# EAGLE design motorController (EAGLE 7.5.0)

## Sheet 1 of 6: MAIN
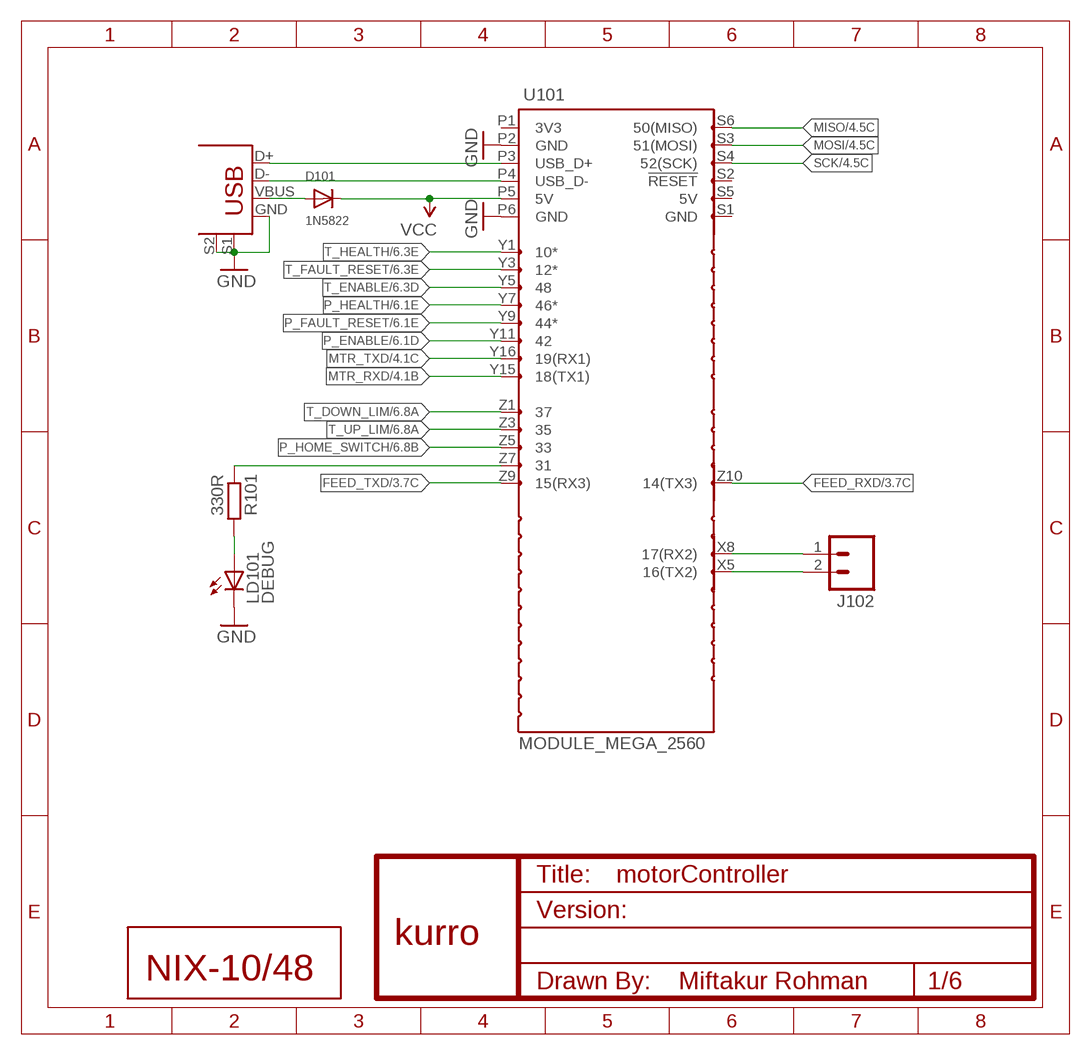
[diagram p0: schematic, sheet 1]

### Parts
D101  1N5822  DIODESMA  [SMADIODE]
J101  USB+SHIELD  [USB-B-PTH]
J102  M02POLAR  [MOLEX-1X2]
LD101  DEBUG  LED5MM  [LED5MM]
R101  330R  R-EU_R0603  [R0603]
U101  MODULE_MEGA_2560  MOD_MEGA_LAYOUT  [MOD_MEGA_LAYOUT]
U$1  KURRO_FOOTPRINT  [KURRO-LOGO]
U$2  NIX  [NIX-XX/XXX]
U$3  MOD_MEGA_LAYOUT_ICSP  [MOD_MEGA_LAYOUT_ICSP]
U$4  MOD_MEGA_LAYOUT_SERIAL1  [MOD_MEGA_LAYOUT_SERIAL1]
U$5  MOD_MEGA_LAYOUT_SERIAL2  [MOD_MEGA_LAYOUT_SERIAL2]
U$6  MOD_MEGA_LAYOUT_SERIAL3  [MOD_MEGA_LAYOUT_SERIAL3]
U$7  MOD_MEGA_LAYOUT_Z_ODD  [MOD_MEGA_LAYOUT_Z_ODD]
U$9  MOD_MEGA_LAYOUT_Y_ODD  [MOD_MEGA_LAYOUT_Y_ODD]

### Nets
FEED_RXD: U$6.Z10(14(TX3)) ; also sheet 3
FEED_TXD: U$6.Z9(15(RX3)) ; also sheet 3
GND: J101.GND J101.S1 J101.S2 LD101.K(C) U101.P2(GND) U101.P6(GND) ; also sheet 2,3,4,5,6
MISO: U$3.S6(50(MISO)) ; also sheet 4
MOSI: U$3.S3(51(MOSI)) ; also sheet 4
MTR_RXD: U$4.Y15(18(TX1)) ; also sheet 4
MTR_TXD: U$4.Y16(19(RX1)) ; also sheet 4
N$3: LD101.A R101.2
N$4: J101.D+ U101.P3(USB_D+)
N$7: J101.D- U101.P4(USB_D-)
N$8: D101.A J101.VBUS
N$9: R101.1 U$7.Z7
N$10: J102.1 U$5.X8(17(RX2))
N$11: J102.2 U$5.X5(16(TX2))
P_ENABLE: U$9.Y11 ; also sheet 6
P_FAULT_RESET: U$9.Y9(44*) ; also sheet 6
P_HEALTH: U$9.Y7(46*) ; also sheet 6
P_HOME_SWITCH: U$7.Z5 ; also sheet 6
SCK: U$3.S4(52(SCK)) ; also sheet 4
T_DOWN_LIM: U$7.Z1 ; also sheet 6
T_ENABLE: U$9.Y5 ; also sheet 6
T_FAULT_RESET: U$9.Y3(12*) ; also sheet 6
T_HEALTH: U$9.Y1(10*) ; also sheet 6
T_UP_LIM: U$7.Z3 ; also sheet 6
VCC: D101.C U101.P5(5V) ; also sheet 2,3,4
Unconnected: U101.P1(3V3) U$3.S1(GND) U$3.S2(!RESET) U$3.S5(5V)

## Sheet 2 of 6: PSU
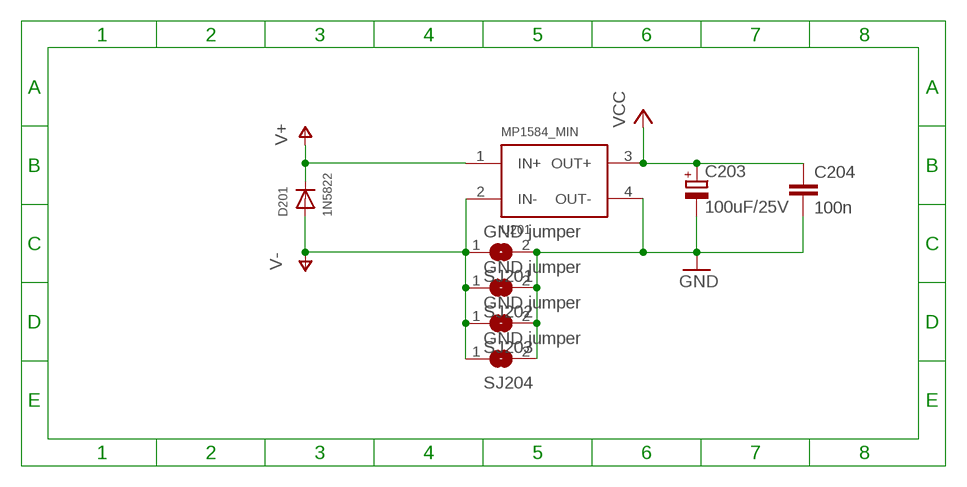
[diagram p1: schematic, sheet 2]

### Parts
C203  100uF/25V  CPOL-EUE5-10.5  [E5-10,5]
C204  100n  C-EUC0603  [C0603]
D201  1N5822  DIODESMA  [SMADIODE]
SJ201  GND jumper  SJS  [SJS]
SJ202  GND jumper  SJS  [SJS]
SJ203  GND jumper  SJS  [SJS]
SJ204  GND jumper  SJS  [SJS]
U201  MP1584_MIN  [MP1584_MIN]

### Nets
GND: C203.- C204.2 SJ201.2 SJ202.2 SJ203.2 SJ204.2 U201.4(OUT-) ; also sheet 1,3,4,5,6
V+ [pwr]: D201.C U201.1(IN+) ; also sheet 5,6
V- [pwr]: D201.A SJ201.1 SJ202.1 SJ203.1 SJ204.1 U201.2(IN-) ; also sheet 5,6
VCC: C203.+ C204.1 U201.3(OUT+) ; also sheet 1,3,4

## Sheet 3 of 6: FEEDBACK
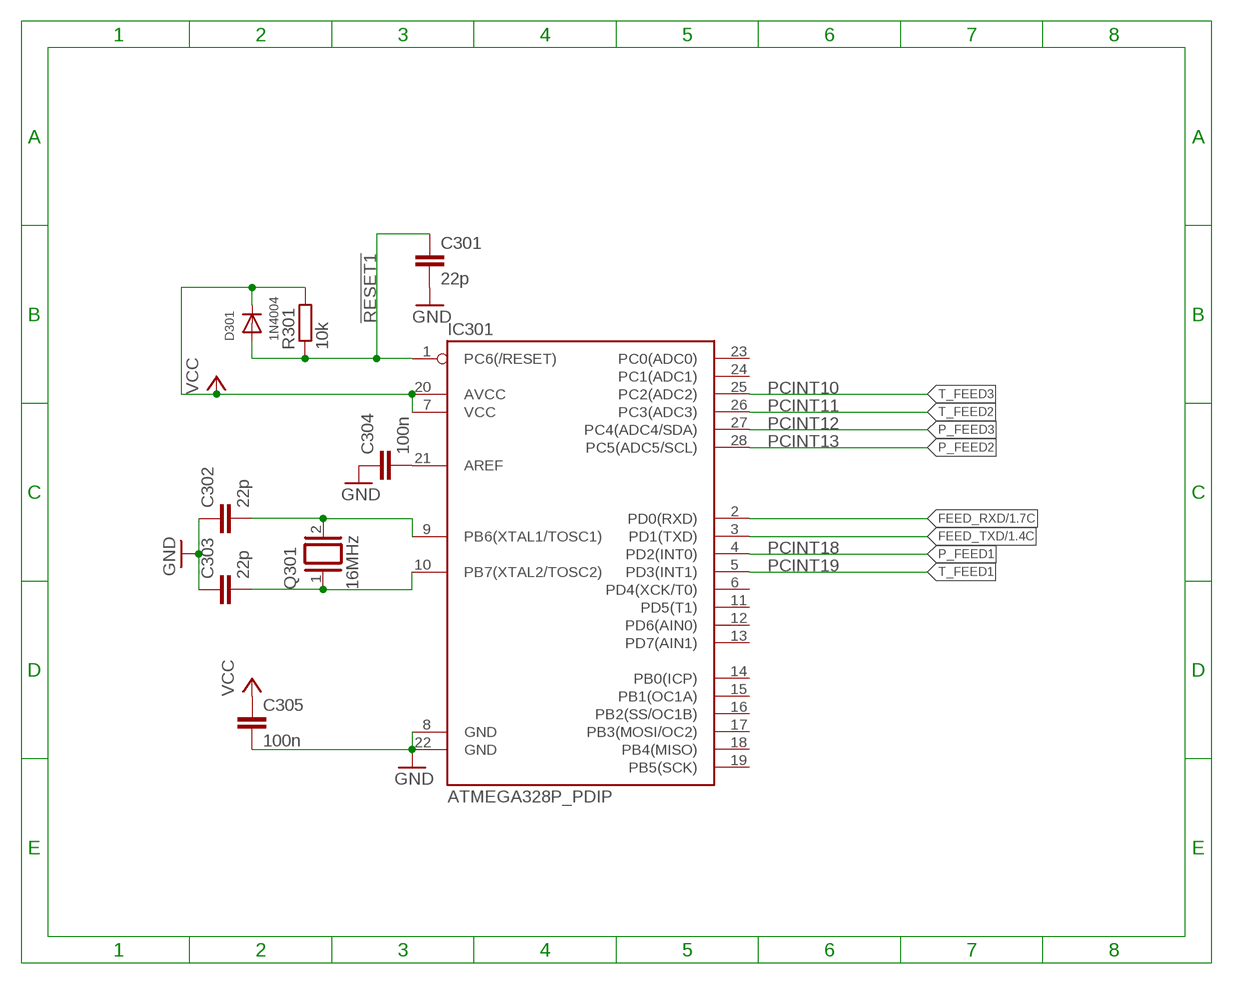
[diagram p2: schematic, sheet 3]

### Parts
C301  22p  C-EUC0603  [C0603]
C302  22p  C-EUC0603  [C0603]
C303  22p  C-EUC0603  [C0603]
C304  100n  C-EUC0603  [C0603]
C305  100n  C-EUC0603  [C0603]
D301  1N4004  DIODESOD-323F  [SOD-323F]
IC301  ATMEGA328P_PDIP  [DIL28-3]
Q301  16MHz  XTAL/S  [QS]
R301  10k  R-EU_R0603  [R0603]

### Nets
!RESET1: C301.1 D301.A IC301.1(PC6(/RESET)) R301.1
FEED_RXD: IC301.2(PD0(RXD)) ; also sheet 1
FEED_TXD: IC301.3(PD1(TXD)) ; also sheet 1
GND: C301.2 C302.1 C303.1 C304.1 C305.2 IC301.8(GND) IC301.22(GND) ; also sheet 1,2,4,5,6
N$5: C303.2 IC301.10(PB7(XTAL2/TOSC2)) Q301.1
N$6: C302.2 IC301.9(PB6(XTAL1/TOSC1)) Q301.2
N$14: C304.2 IC301.21(AREF)
P_FEED1: IC301.4(PD2(INT0)) ; also sheet 6
P_FEED2: IC301.28(PC5(ADC5/SCL)) ; also sheet 6
P_FEED3: IC301.27(PC4(ADC4/SDA)) ; also sheet 6
T_FEED1: IC301.5(PD3(INT1)) ; also sheet 6
T_FEED2: IC301.26(PC3(ADC3)) ; also sheet 6
T_FEED3: IC301.25(PC2(ADC2)) ; also sheet 6
VCC: C305.1 D301.C IC301.7(VCC) IC301.20(AVCC) R301.2 ; also sheet 1,2,4
Unconnected: IC301.6(PD4(XCK/T0)) IC301.11(PD5(T1)) IC301.12(PD6(AIN0)) IC301.13(PD7(AIN1)) IC301.14(PB0(ICP)) IC301.15(PB1(OC1A)) IC301.16(PB2(SS/OC1B)) IC301.17(PB3(MOSI/OC2)) IC301.18(PB4(MISO)) IC301.19(PB5(SCK)) IC301.23(PC0(ADC0)) IC301.24(PC1(ADC1))

### Notes on the sheet
- PCINT10
- PCINT11
- PCINT12
- PCINT13
- PCINT18
- PCINT19

## Sheet 4 of 6: COMM
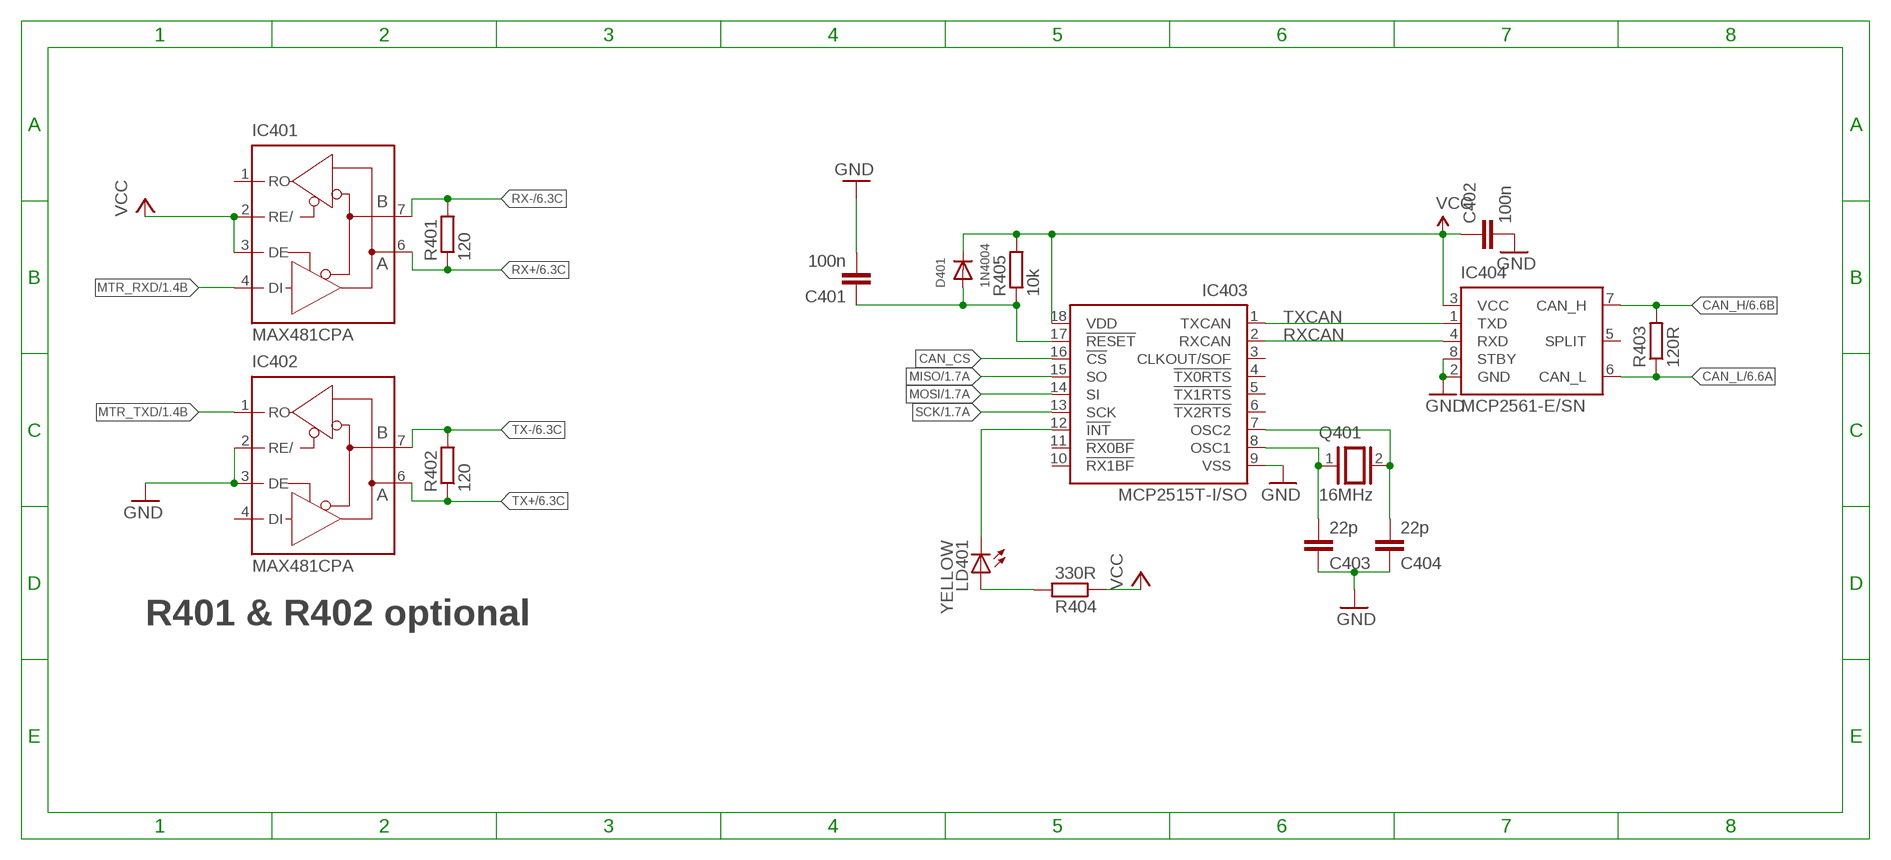
[diagram p3: schematic, sheet 4]

### Parts
C401  100n  C-EUC0603  [C0603]
C402  100n  C-EUC0603  [C0603]
C403  22p  C-EUC0603  [C0603]
C404  22p  C-EUC0603  [C0603]
D401  1N4004  DIODESOD-323F  [SOD-323F]
IC401  MAX481CPA  [DIL08]
IC402  MAX481CPA  [DIL08]
IC403  MCP2515T-I/SO  [SO-18]
IC404  MCP2561-E/SN  [SOIC-8]
LD401  YELLOW  LED5MM  [LED5MM]
Q401  16MHz  XTAL/S  [QS]
R401  120  R-EU_R0603  [R0603]
R402  120  R-EU_R0603  [R0603]
R403  120R  R-EU_R0603  [R0603]
R404  330R  R-EU_R0603  [R0603]
R405  10k  R-EU_R0603  [R0603]

### Nets
CAN_CS: IC403.16(!CS)
CAN_H: IC404.7(CAN_H) R403.2 ; also sheet 6
CAN_INT: IC403.12(!INT) LD401.K(C)
CAN_L: IC404.6(CAN_L) R403.1 ; also sheet 6
GND: C401.2 C402.2 C403.1 C404.1 IC402.2(RE/) IC402.3(DE) IC403.9(VSS) IC404.2(GND) IC404.8(STBY) ; also sheet 1,2,3,5,6
MISO: IC403.15(SO) ; also sheet 1
MOSI: IC403.14(SI) ; also sheet 1
MTR_RXD: IC401.4(DI) ; also sheet 1
MTR_TXD: IC402.1(RO) ; also sheet 1
N$21: C401.1 D401.A IC403.17(!RESET) R405.1
N$22: C403.2 IC403.8(OSC1) Q401.1
N$23: C404.2 IC403.7(OSC2) Q401.2
N$24: LD401.A R404.2
RX+: IC401.6(A) R401.1 ; also sheet 6
RX-: IC401.7(B) R401.2 ; also sheet 6
RXCAN: IC403.2(RXCAN) IC404.4(RXD)
SCK: IC403.13(SCK) ; also sheet 1
TX+: IC402.6(A) R402.1 ; also sheet 6
TX-: IC402.7(B) R402.2 ; also sheet 6
TXCAN: IC403.1(TXCAN) IC404.1(TXD)
VCC: C402.1 D401.C IC401.2(RE/) IC401.3(DE) IC403.18(VDD) IC404.3(VCC) R404.1 R405.2 ; also sheet 1,2,3
Unconnected: IC401.1(RO) IC402.4(DI) IC403.3(CLKOUT/SOF) IC403.4(!TX0RTS) IC403.5(!TX1RTS) IC403.6(!TX2RTS) IC403.10(!RX1BF) IC403.11(!RX0BF) IC404.5(SPLIT)

### Notes on the sheet
- R401 & R402 optional

## Sheet 5 of 6: TRIGGER
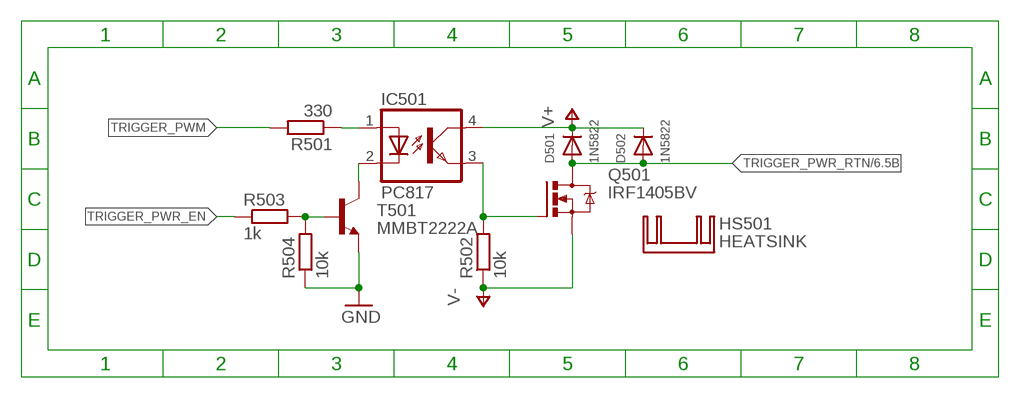
[diagram p4: schematic, sheet 5]

### Parts
D501  1N5822  DIODESMA  [SMADIODE]
D502  1N5822  DIODESMA  [SMADIODE]
HS501  HEATSINK  TO220T30  [BV_150X105]
IC501  PC817  [DIL04]
Q501  IRF1405BV  [TO220BV]
R501  330  R-EU_R0603  [R0603]
R502  10k  R-EU_R0603  [R0603]
R503  1k  R-EU_R0603  [R0603]
R504  10k  R-EU_R0603  [R0603]
T501  MMBT2222A  TRANSISTOR_NPNSOT23  [SOT23]

### Nets
GND: R504.1 T501.2(E) ; also sheet 1,2,3,4,6
N$1: IC501.2(C) T501.3(C)
N$85: R503.2 R504.2 T501.1(B)
N$86: IC501.1(A) R501.1
N$89: IC501.3(EMIT) Q501.G R502.2
TRIGGER_PWM: R501.2
TRIGGER_PWR_EN: R503.1
TRIGGER_PWR_RTN [pwr]: D501.A D502.A Q501.D ; also sheet 6
V+ [pwr]: D501.C D502.C IC501.4(COL) ; also sheet 2,6
V- [pwr]: Q501.S R502.1 ; also sheet 2,6

## Sheet 6 of 6: CONNECTOR
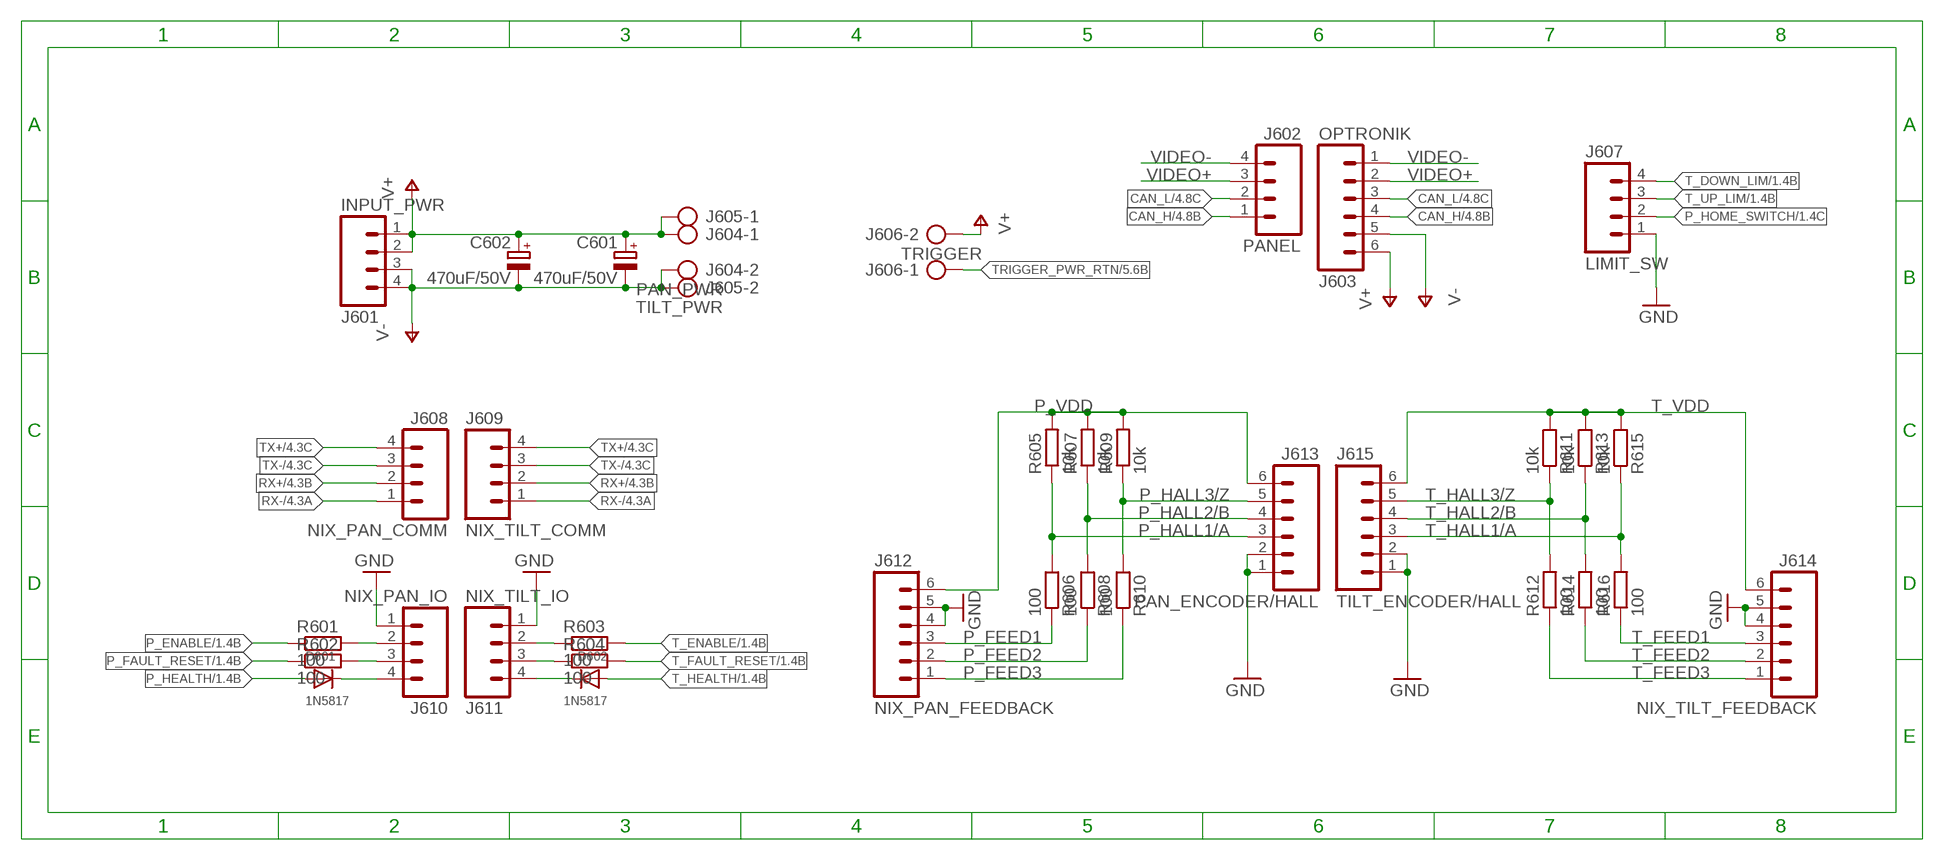
[diagram p5: schematic, sheet 6]

### Parts
C601  470uF/50V  CPOL-EUE5-10.5  [E5-10,5]
C602  470uF/50V  CPOL-EUE5-10.5  [E5-10,5]
D601  1N5817  DIODESOD-323F  [SOD-323F]
D602  1N5817  DIODESOD-323F  [SOD-323F]
J601  INPUT_PWR  M04-XH-RA  [XH-4-RA]
J602  PANEL  M04-XH-RA  [XH-4-RA]
J603  OPTRONIK  M06-XH-RA  [XH-6-RA]
J604  PAN_PWR  AK200/2  [AK200/2]
J605  TILT_PWR  AK200/2  [AK200/2]
J606  TRIGGER  AK200/2  [AK200/2]
J607  LIMIT_SW  M04-XH-RA  [XH-4-RA]
J608  NIX_PAN_COMM  M04-XH-RA  [XH-4-RA]
J609  NIX_TILT_COMM  M04-XH-RA  [XH-4-RA]
J610  NIX_PAN_IO  M04-XH-RA  [XH-4-RA]
J611  NIX_TILT_IO  M04-XH-RA  [XH-4-RA]
J612  NIX_PAN_FEEDBACK  M06-XH-RA  [XH-6-RA]
J613  PAN_ENCODER/HALL  M06POLAR  [MOLEX-1X6]
J614  NIX_TILT_FEEDBACK  M06-XH-RA  [XH-6-RA]
J615  TILT_ENCODER/HALL  M06POLAR  [MOLEX-1X6]
R601  100  R-EU_R0603  [R0603]
R602  100  R-EU_R0603  [R0603]
R603  100  R-EU_R0603  [R0603]
R604  100  R-EU_R0603  [R0603]
R605  10k  R-EU_R0603  [R0603]
R606  100  R-EU_R0603  [R0603]
R607  10k  R-EU_R0603  [R0603]
R608  100  R-EU_R0603  [R0603]
R609  10k  R-EU_R0603  [R0603]
R610  100  R-EU_R0603  [R0603]
R611  10k  R-EU_R0603  [R0603]
R612  100  R-EU_R0603  [R0603]
R613  10k  R-EU_R0603  [R0603]
R614  100  R-EU_R0603  [R0603]
R615  10k  R-EU_R0603  [R0603]
R616  100  R-EU_R0603  [R0603]

### Nets
CAN_H: J602.1 J603.4 ; also sheet 4
CAN_L: J602.2 J603.3 ; also sheet 4
GND: J607.1 J610.1 J611.1 J612.4 J612.5 J613.1 J613.2 J614.4 J614.5 J615.1 J615.2 ; also sheet 1,2,3,4,5
N$19: J611.2 R603.1
N$20: J611.3 R604.1
N$90: D602.C J611.4
N$106: D601.C J610.4
N$107: J610.2 R601.2
N$108: J610.3 R602.2
P_ENABLE: R601.1 ; also sheet 1
P_FAULT_RESET: R602.1 ; also sheet 1
P_FEED1: J612.3 R606.1 ; also sheet 3
P_FEED2: J612.2 R608.1 ; also sheet 3
P_FEED3: J612.1 R610.1 ; also sheet 3
P_HALL1/A: J613.3 R605.1 R606.2
P_HALL2/B: J613.4 R607.1 R608.2
P_HALL3/Z: J613.5 R609.1 R610.2
P_HEALTH: D601.A ; also sheet 1
P_HOME_SWITCH: J607.2 ; also sheet 1
P_VDD: J612.6 J613.6 R605.2 R607.2 R609.2
RX+: J608.2 J609.2 ; also sheet 4
RX-: J608.1 J609.1 ; also sheet 4
T_DOWN_LIM: J607.4 ; also sheet 1
T_ENABLE: R603.2 ; also sheet 1
T_FAULT_RESET: R604.2 ; also sheet 1
T_FEED1: J614.3 R616.1 ; also sheet 3
T_FEED2: J614.2 R614.1 ; also sheet 3
T_FEED3: J614.1 R612.1 ; also sheet 3
T_HALL1/A: J615.3 R615.1 R616.2
T_HALL2/B: J615.4 R613.1 R614.2
T_HALL3/Z: J615.5 R611.1 R612.2
T_HEALTH: D602.A ; also sheet 1
T_UP_LIM: J607.3 ; also sheet 1
T_VDD: J614.6 J615.6 R611.2 R613.2 R615.2
TRIGGER_PWR_RTN [pwr]: J606.1 ; also sheet 5
TX+: J608.4 J609.4 ; also sheet 4
TX-: J608.3 J609.3 ; also sheet 4
V+ [pwr]: C601.+ C602.+ J601.1 J601.2 J603.6 J604.1 J605.1 J606.2 ; also sheet 2,5
V- [pwr]: C601.- C602.- J601.3 J601.4 J603.5 J604.2 J605.2 ; also sheet 2,5
VIDEO+: J602.3 J603.2
VIDEO-: J602.4 J603.1

## Power pins joined to a net without a drawn wire
GND: IC401.5(GND) IC402.5(GND)
VCC: IC401.8(VCC) IC402.8(VCC)

## Library data of the parts
C203 C601 C602 = resistor:CPOL-EU: POLARIZED CAPACITOR, European symbol
C204 C301 C304 C305 = resistor:C-EU: CAPACITOR, European symbol
C302 C303 C401-C404 = rcl:C-EU: CAPACITOR, European symbol
D101 D201 D301 D401 D501 D502 D601 D602 = adafruit:DIODE: Diode SMADIODE - SMA Surface Mount Package 20V 1A Schottky Diode Digikey: 641-1014-6-ND DO-1N4148 - Through Hole Small Current Diode SOD-123 20V 1 A (.5mV Vf) Schottky Diode - Digikey: MBRX120TPMSCT-ND SOD-323 10V 570mA (.38mV Vf, 3ns) Schottky Diode - Digikey: ZLLS410CT-ND SOD-523 30V 30mA Schottky Diode (RB751S-40TE61) - Digikey: RB751S-40TE61CT-ND SOT23-R/W - SOT23 Package (R = Solder Paste/Reflow Ovens, W = Hand-Soldering) BAT54Film 40V 300mA - Digikey: 497-7162-1-ND
HS501 = heatsink:TO220: HEATSINK Heatsink for TO220
IC301 = SparkFun-DigitalIC:ATMEGA328P_PDIP: uC used in the Arduino 32kb flash, 1k EEPROM, 2k SRAM This is the through-hole version of this chip.
IC401 IC402 = maxim:MAX481CPA: RS485 TRANSEIVER
IC403 = microchip:MCP2515: Stand-Alone CAN Controller with SPI Interface http://www.microchip.com/mymicrochip/filehandler.aspx?ddocname=en011733
IC404 = microchip:MCP256*
IC501 = optocoupler:PC817: SHARP OPTO COUPLER
J101 = SparkFun-Connectors:USB+SHIELD: USB+Shield USB connector with shield pins connectable
J102 = SparkFun-Connectors:M02: Standard 2-pin 0.1" header. Use with - straight break away headers ( PRT-00116) - right angle break away headers (PRT-00553) - swiss pins (PRT-00743) - machine pins (PRT-00117) - female headers (PRT-00115) Molex polarized connector foot print use with: PRT-08233 with associated crimp pins and housings. 2.54_SCREWTERM for use with PRT-10571. 3.5mm Screw Terminal footprints for PRT-08084 5mm Screw Terminal footprints for use with PRT-08433
J601 J602 J607-J611 = SparkFun-Connectors:M04: Header 4 Standard 4-pin 0.1" header. Use with straight break away headers (SKU : PRT-00116), right angle break away headers (PRT-00553), swiss pins (PRT-00743), machine pins (PRT-00117), and female headers (PRT-00115). Molex polarized connector foot print use with SKU : PRT-08231 with associated crimp pins and housings. 1MM SMD Version SKU: PRT-10208
J603 J612-J615 = SparkFun-Connectors:M06: Header 6 Standard 6-pin 0.1" header. Use with straight break away headers (SKU : PRT-00116), right angle break away headers (PRT-00553), swiss pins (PRT-00743), machine pins (PRT-00117), and female headers (PRT-00115). Molex polarized connector foot print use with SKU : PRT-08094 with associated crimp pins and housings. NOTES ON THE VARIANTS LOCK and LOCK_LONGPADS... This footprint was designed to help hold the alignment of a through-hole component (i.e. 6-pin header) while soldering it into place. You may notice that each hole has been shifted either up or down by 0.005 of an inch from it's more standard position (which is a perfectly straight line). This slight alteration caused the pins (the squares in the middle) to touch the edges of the holes. Because they are alternating, it causes a "brace" to hold the component in place. 0.005 has proven to be the perfect amount of "off-center" position when using our standard breakaway headers. Although looks a little odd when you look at the bare footprint, once you have a header in there, the alteration is very hard to notice. Also,if you push a header all the way into place, it is covered up entirely on the bottom side. This idea of altering the position of holes to aid alignment will be further integrated into the Sparkfun Library for other footprints. It can help hold any component with 3 or more connection pins.
J604-J606 = con-ptr500:AK200/2
LD101 = adafruit:LED: LED
LD401 = led:LED: LED
Q301 Q401 = special:XTAL/S: CRYSTAL
Q501 = transistor-power:IRF1405: N-CHANNEL HEXFET POWER MOSFET ID (MAX)= 169A
R101 R404 R501-R504 = resistor:R-EU_: RESISTOR, European symbol
R301 R401-R403 R405 R601-R616 = rcl:R-EU_: RESISTOR, European symbol
SJ201-SJ204 = jumper:SJ: SMD solder JUMPER
T501 = SparkFun-DiscreteSemi:TRANSISTOR_NPN: Generic NPN BJT MMBT2222A - TRANS-08049 (SOT-23, 1A 40V) MPSA42 - TRANS-09116 (SOT-23, 500mA 300V) MMBT5088LT1G - TRANS-11160 (SOT-23, 50 mA 30V)
U101 = encPhone:MOD_MEGA_LAYOUT
U201 = SparkFun-Boards:MP1584
U$1 = SparkFun:KURRO_FOOTPRINT
U$2 = scorpion:NIX
U$3 = encPhone:MOD_MEGA_LAYOUT_ICSP
U$4 = encPhone:MOD_MEGA_LAYOUT_SERIAL1
U$5 = encPhone:MOD_MEGA_LAYOUT_SERIAL2
U$6 = encPhone:MOD_MEGA_LAYOUT_SERIAL3
U$7 = encPhone:MOD_MEGA_LAYOUT_Z_ODD
U$9 = encPhone:MOD_MEGA_LAYOUT_Y_ODD

## Net classes
0 default: width 0.406 mm, drill 0.6 mm, clearance 0.305 mm
2 pwr: width 0.61 mm, drill 0.59 mm, clearance 0.305 mm

## Board
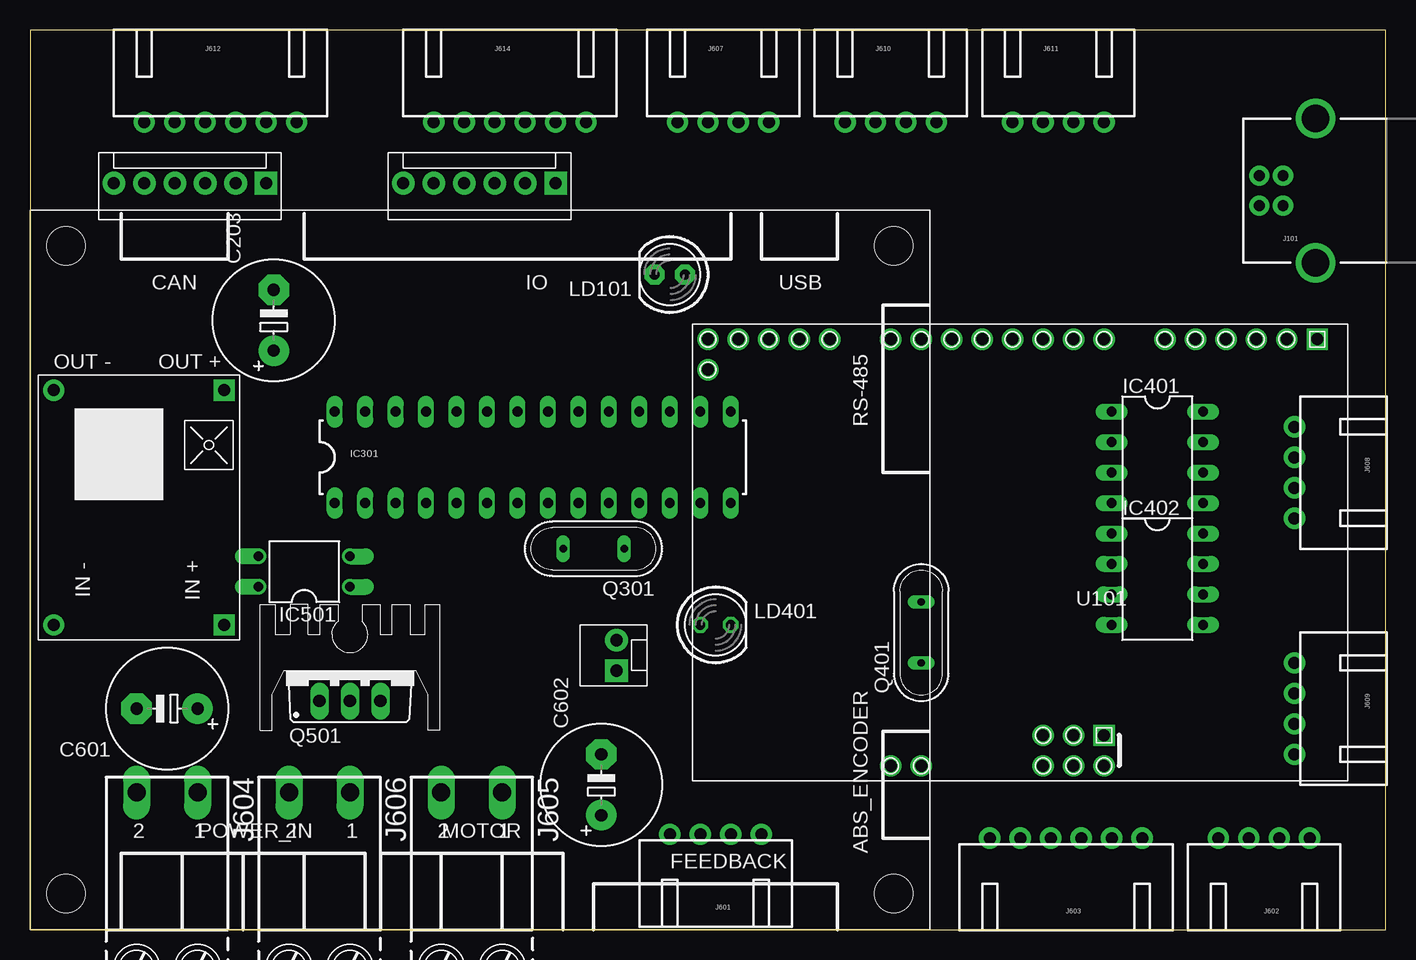
[diagram p6: board, top side]
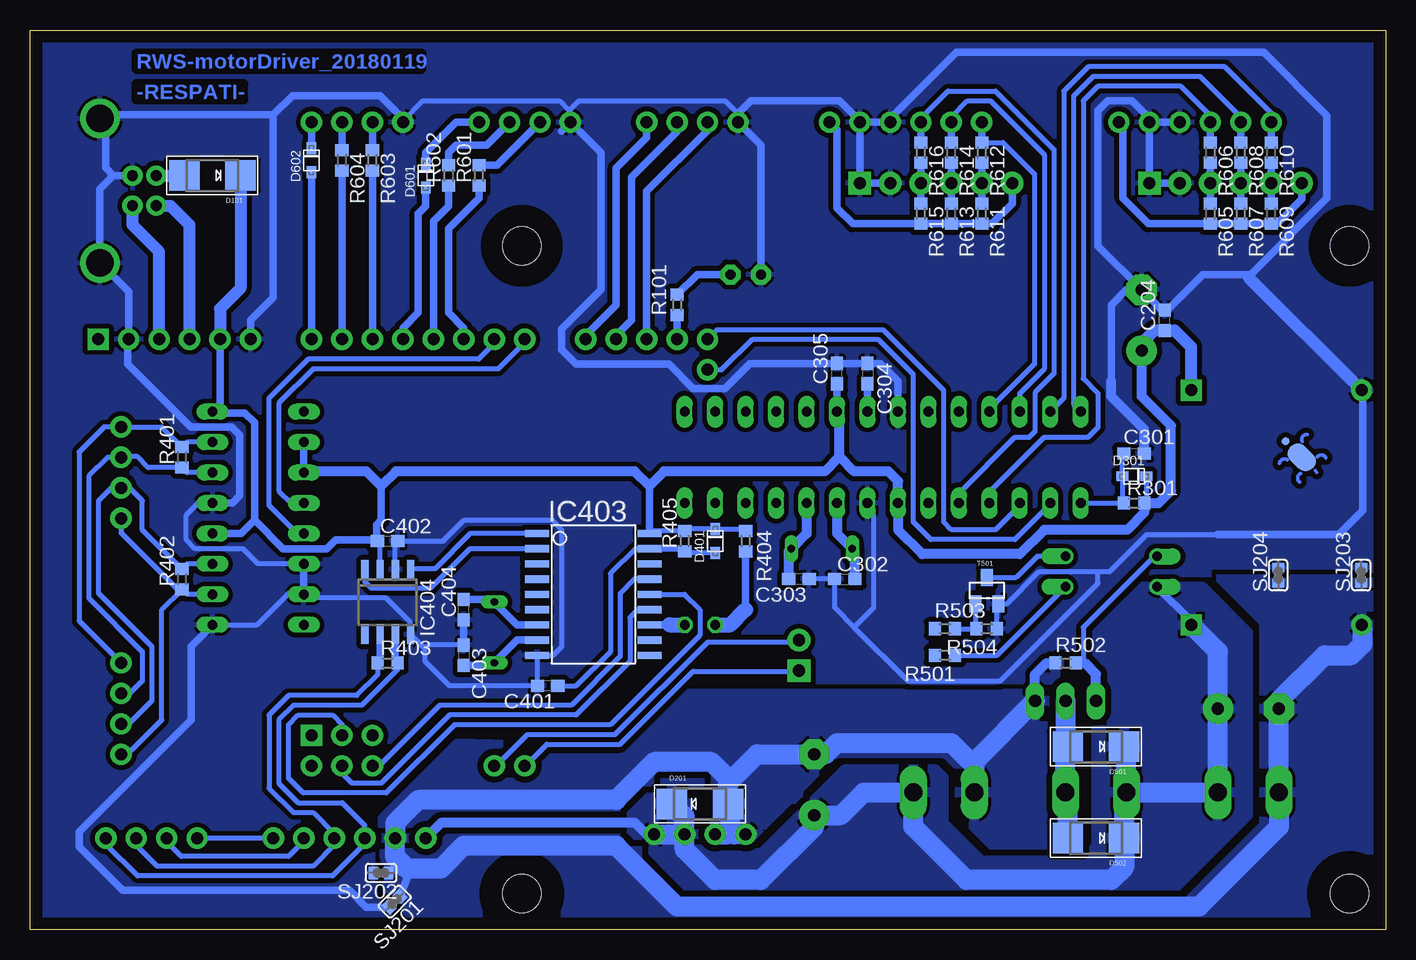
[diagram p7: board, bottom side, seen from below]

Size 113 x 75 mm. Coordinates in mm from the lower left corner, seen from the top.
Outline: 0,0 113,0 113,75 0,75 0,0
Copper layers (1*16): Top 0.035mm / dielectric 1.5mm / Bottom 0.035mm
Design rules "default": minimum track width 10mil, minimum drill 24mil, track to track 8mil, track to pad 8mil, pad to pad 8mil, via to via 8mil, smd to smd 8mil, copper to edge 40mil, drill to drill 8mil, minimum pad ring 10mil, minimum via ring 8mil, stop-mask expansion 4mil, vias tented up to drill 0mil, thermal gap 10mil
bRestrict: area 97.2,61.6 to 98.4,64.1; area 56.5,9.5 to 57.1,11.4

### Footprints (pad centres in the part's own frame; a part is rotated, then mirrored left to right if it is on the bottom)
E5-10,5 = drill 1.016 pad 2.54: + -2.54,0 | drill 1.016 pad 2.54 octagon: - 2.54,0
C0603 = smd 1.1 x 1: 1 -0.85,0; 2 0.85,0
SMADIODE = smd 2.54 x 2.54: A 2.349,0; C -2.349,0
SOD-323F = smd 1 x 0.8: A -1,0; C 1,0
DIL28-3 = drill 0.813 long: 1 -16.51,-3.81; 2 -13.97,-3.81; 3 -11.43,-3.81; 4 -8.89,-3.81; 5 -6.35,-3.81; 6 -3.81,-3.81; 7 -1.27,-3.81; 8 1.27,-3.81; 9 3.81,-3.81; 10 6.35,-3.81; 11 8.89,-3.81; 12 11.43,-3.81; 13 13.97,-3.81; 14 16.51,-3.81; 15 16.51,3.81; 16 13.97,3.81; 17 11.43,3.81; 18 8.89,3.81; 19 6.35,3.81; 20 3.81,3.81; 21 1.27,3.81; 22 -1.27,3.81; 23 -3.81,3.81; 24 -6.35,3.81; 25 -8.89,3.81; 26 -11.43,3.81; 27 -13.97,3.81; 28 -16.51,3.81
DIL08 = drill 0.813 long: 1 -3.81,-3.81; 2 -1.27,-3.81; 3 1.27,-3.81; 4 3.81,-3.81; 5 3.81,3.81; 6 1.27,3.81; 7 -1.27,3.81; 8 -3.81,3.81
SO-18 = smd 0.6 x 2: 1 -5.08,-4.7; 2 -3.81,-4.7; 3 -2.54,-4.7; 4 -1.27,-4.7; 5 0,-4.7; 6 1.27,-4.7; 7 2.54,-4.7; 8 3.81,-4.7; 9 5.08,-4.7; 10 5.08,4.7; 11 3.81,4.7; 12 2.54,4.7; 13 1.27,4.7; 14 0,4.7; 15 -1.27,4.7; 16 -2.54,4.7; 17 -3.81,4.7; 18 -5.08,4.7
SOIC-8 = smd 0.6 x 1.6: 1 -1.905,-2.7; 2 -0.635,-2.7; 3 0.635,-2.7; 4 1.905,-2.7; 5 1.905,2.7; 6 0.635,2.7; 7 -0.635,2.7; 8 -1.905,2.7
DIL04 = drill 0.813 offset: 1 -1.27,-3.81; 2 1.27,-3.81; 3 1.27,3.81; 4 -1.27,3.81
USB-B-PTH = drill 0.914 pad 1.676: D+ 0,1.25; D- 1.981,1.25; GND 0,-1.25; VBUS 1.981,-1.25 | drill 2.286: S1 -2.718,-6.02; S2 -2.718,6.02
MOLEX-1X2 = drill 1.016 pad 1.88 square: 1 0,0 | drill 1.016 pad 1.88: 2 2.54,0
XH-4-RA = drill 1 pad 1.778: 1 -3.81,0; 2 -1.27,0; 3 1.27,0; 4 3.81,0
XH-6-RA = drill 1 pad 1.778: 1 -6.35,0; 2 -3.81,0; 3 -1.27,0; 4 1.27,0; 5 3.81,0; 6 6.35,0
AK200/2 = drill 1.5 long: 1 -2.54,0; 2 2.54,0
MOLEX-1X6 = drill 1.016 pad 1.88 square: 1 0,0 | drill 1.016 pad 1.88: 2 2.54,0; 3 5.08,0; 4 7.62,0; 5 10.16,0; 6 12.7,0
LED5MM = drill 0.813 pad 1.676 octagon: A -1.27,0; K 1.27,0
LED5MM' = drill 0.813 octagon: A -1.27,0; K 1.27,0
QS = drill 0.61 long: 1 -2.54,0; 2 2.54,0
TO220BV = drill 1.016 long: D 0,-2.54; G -2.54,-2.54; S 2.54,-2.54
R0603 = smd 1 x 1.1: 1 -0.85,0; 2 0.85,0
SJS = smd 0.762 x 1.016: 1 -0.635,0; 2 0.635,0
SOT23 = smd 1 x 1.4: 1 -0.95,-1.1; 2 0.95,-1.1; 3 0,1.1
MOD_MEGA_LAYOUT = drill 1 pad 1.778 square: P1 2.54,1.27 | drill 1 pad 1.778: P2 5.08,1.27; P3 7.62,1.27; P4 10.16,1.27; P5 12.7,1.27; P6 15.24,1.27
MP1584_MIN = drill 1 pad 1.778 square: 1 1.27,1.27; 3 20.83,1.27 | drill 1 pad 1.778: 2 1.27,15.49; 4 20.83,15.49
KURRO-LOGO = smd 2.54 x 1.651 rotated 45 bottom: P$1 0,0 | smd 0.635 x 0.635 rotated 45 bottom: P$2 1.347,1.347
NIX-XX/XXX = hole 3.2: 3,3; 72,57; 72,3; 3,57
MOD_MEGA_LAYOUT_ICSP = drill 1 pad 1.778 square: S1 20.32,34.29 | drill 1 pad 1.778: S2 20.32,36.83; S3 22.86,34.29; S4 22.86,36.83; S5 25.4,34.29; S6 25.4,36.83
MOD_MEGA_LAYOUT_SERIAL1 = drill 1 pad 1.778: Y15 38.1,1.27; Y16 35.56,1.27
MOD_MEGA_LAYOUT_SERIAL2 = drill 1 pad 1.778: X5 35.56,36.83; X8 38.1,36.83
MOD_MEGA_LAYOUT_SERIAL3 = drill 1 pad 1.778: Z9 53.34,1.27; Z10 53.34,3.81
MOD_MEGA_LAYOUT_Z_ODD = drill 1 pad 1.778: Z1 43.18,1.27; Z3 45.72,1.27; Z5 48.26,1.27; Z7 50.8,1.27
MOD_MEGA_LAYOUT_Y_ODD = drill 1 pad 1.778: Y1 20.32,1.27; Y3 22.86,1.27; Y5 25.4,1.27; Y7 27.94,1.27; Y9 30.48,1.27; Y11 33.02,1.27

### Placement (x,y rotation side)
C203  20.32,50.8 90 top
C204  18.41,50.8 90 bottom
C301  20.95,39.69 0 bottom
C302  45.09,29.21 0 bottom
C303  48.9,29.21 180 bottom
C304  43.18,46.35 270 bottom
C305  45.72,46.35 90 bottom
C401  69.85,20.32 180 bottom
C402  83.19,32.38 0 bottom
C403  76.83,22.86 270 bottom
C404  76.83,26.67 90 bottom
C601  11.43,18.41 180 top
C602  47.62,12.06 90 top
D101  97.79,62.87 180 bottom
D201  57.15,10.48 0 bottom
D301  20.95,37.78 0 bottom
D401  55.88,32.38 90 bottom
D501  24.13,15.24 180 bottom
D502  24.13,7.62 180 bottom
D601  80.01,62.87 90 bottom
D602  89.53,64.14 90 bottom
HS501  26.67,21.59 0 top
IC301  41.91,39.37 0 top
IC401  93.98,39.37 270 top
IC402  93.98,29.21 270 top
IC403  66.04,27.94 270 bottom
IC404  83.19,27.3 180 bottom
IC501  22.86,29.84 90 top
J101  104.46,61.59 180 top
J102  48.9,21.59 90 top
J601  57.15,7.94 180 top
J602  102.87,7.62 180 top
J603  86.36,7.62 180 top
J604  11.43,11.43 180 top
J605  36.83,11.43 180 top
J606  24.13,11.43 180 top
J607  57.78,67.31 0 top
J608  105.41,38.1 270 top
J609  105.41,18.41 270 top
J610  71.75,67.31 0 top
J611  85.72,67.31 0 top
J612  15.88,67.31 0 top
J613  19.68,62.23 180 top
J614  40.01,67.31 0 top
J615  43.81,62.23 180 top
LD101  53.34,54.61 180 top
LD401  YELLOW  [LED5MM']  57.15,25.4 0 top
Q301  46.99,31.75 180 top
Q401  74.3,24.77 90 top
Q501  26.67,21.59 0 top
R101  59.05,52.07 90 bottom
R301  20.95,35.56 0 bottom
R401  100.33,39.37 90 bottom
R402  100.33,29.21 90 bottom
R403  83.19,22.23 0 bottom
R404  53.34,32.38 270 bottom
R405  58.42,32.38 90 bottom
R501  36.73,22.86 180 bottom
R502  26.67,22.23 0 bottom
R503  36.73,25.08 0 bottom
R504  33.24,25.08 180 bottom
R601  75.56,62.87 90 bottom
R602  78.11,62.87 90 bottom
R603  84.45,64.14 270 bottom
R604  87,64.14 270 bottom
R605  14.61,59.69 270 bottom
R606  14.61,64.77 270 bottom
R607  12.06,59.69 270 bottom
R608  12.06,64.77 270 bottom
R609  9.53,59.69 270 bottom
R610  9.53,64.77 270 bottom
R611  33.66,59.69 270 bottom
R612  33.66,64.77 270 bottom
R613  36.2,59.69 270 bottom
R614  36.2,64.77 270 bottom
R615  38.73,59.69 270 bottom
R616  38.73,64.77 270 bottom
SJ201  82.61,2.32 225 bottom
SJ202  83.74,4.71 180 bottom
SJ203  2.03,29.54 90 bottom
SJ204  8.94,29.54 90 bottom
T501  33.24,28.26 0 bottom
U101  109.86,50.48 180 top
U201  17.46,24.13 90 top
U$1  6.99,39.37 0 top
U$2  0,0 0 top
U$3  109.86,50.48 180 top
U$4  109.86,50.48 180 top
U$5  109.86,50.48 180 top
U$6  109.86,50.48 180 top
U$7  109.86,50.48 180 top
U$9  109.86,50.48 180 top

### Tracks (layer width: path | path; a pad name or v marks a point on that pad's centre or on a via)
!RESET1
  Bottom 0.406: IC301.1 R301.1 21.95,35.71 D301.A 21.95,39.54 C301.1
CAN_H
  Bottom 0.406: J602.1 106.68,7.11 104.04,4.47 87.78,4.47 85.09,7.16 J603.4 85.09,8.69 86.97,10.57 90.63,10.57 92.25,12.19 92.25,17.48 91.03,18.69 85.34,18.69 82.33,21.7 R403.2
  Bottom 0.61: IC404.7 82.55,22.44 R403.2
CAN_INT
  Bottom 0.61: IC403.12 59.69,25.4
  Bottom 1.27: 59.69,25.4 LD401.K
CAN_L
  Bottom 0.406: J602.2 104.14,7.01 102.41,5.28 89.41,5.28 87.63,7.06 J603.3 87.63,7.98 89.41,9.75 91.03,9.75 93.07,11.79 93.07,17.88 91.44,19.51 85.75,19.51 84.03,21.22 R403.1
  Bottom 0.61: IC404.6 83.82,22.44 R403.1
FEED_RXD
  Bottom 0.406: IC301.2 27.94,35.46 30.89,32.51 37.91,32.51 39.37,33.97 39.37,46.28 42.27,49.17 52.83,49.17 55.33,46.67 U$6.Z10
FEED_TXD
  Bottom 0.406: IC301.3 30.48,35.36 32.51,33.33 36.18,33.33 36.83,33.97 36.83,44.96 41.86,49.99 55.74,49.99 U$6.Z9
GND
  Bottom 0.406: 80.06,23.39 80.06,22.35 78.03,20.32 C401.2 70.7,22.82 IC403.9 69.39,22.86 68.68,23.57 68.68,33.33 69.49,34.14 76.81,34.14 78.56,32.38 C402.2 82.55,32.17 IC404.2 | 80.06,23.39 IC404.8 81.28,25.6 83.31,27.64 89.86,27.64 IC402.3 90.27,28.04 91.44,28.04 94.08,25.4 IC402.5 | C403.1 79.74,23.71 80.06,23.39 | C303.1 C302.1 45.94,26.83 44.3,25.2 | R504.1 32.39,27.06 T501.2 31.58,27.16 28.89,29.84 23.98,29.84 | J611.1 81.92,67.41 80.24,69.09 68.86,69.09 68.05,68.28 | 68.05,68.28 67.23,69.09 55.04,69.09 53.98,68.02 J607.1 | 68.05,68.28 68.05,67.41 J610.1 | 23.98,29.84 22.99,29.84 19.91,32.92 14.01,32.92 | 44.3,25.2 39.83,20.73 32.11,20.73 23.98,28.85 23.98,29.84 | IC301.8 43.18,35.05 42.67,34.54 42.67,26.82 44.3,25.2 | IC402.2 93.98,30.48 95.25,31.75 99.21,31.75 99.97,32.51 99.97,34.54 98.96,35.56 IC401.5
  Bottom 0.61: J612.4 J612.5 | J613.2 J613.1 J612.5 | J615.2 J615.1 J614.5 | IC301.22 40.64,45.72 42.12,47.2 C304.1 C305.2 52.97,47.2 55.07,45.11 57.71,45.11 59.74,47.14 67.46,47.14 68.68,48.36 68.68,50.06 65.41,53.34 65.41,64.77 J610.1 68.68,66.57 | C404.1 C403.1 | J612.5 19.68,67.64 21.13,69.09 23.16,69.09 23.98,68.28 23.98,57 C203.- | J614.5 J614.4 41.27,67.64 35.76,73.15 10.16,73.15 4.88,67.87 4.88,60.96 11.43,54.41 11.62,54.61 15.24,54.61 18.2,51.65 C204.2 18.63,51.65 C203.- | J614.5 43.81,67.39 45.52,69.09 52.91,69.09 53.98,68.02 | IC402.3 IC402.2 | J101.S1 106.69,67.61 106.69,67.31 | J611.1 82.23,67.63 82.23,67.94 83.82,69.53 91.12,69.53 92.71,67.94 | 106.05,62.87 107.17,61.73 J101.S2 104.78,53.17 U101.P2 104.85,49.14 104.85,47.14 99.62,41.91 96.2,41.91 95.5,41.21 95.5,36.17 96.11,35.56 IC401.5 | 106.05,62.87 104.48,62.87 J101.GND | 106.69,67.31 106.69,63.51 106.05,62.87 | IC402.5 99.57,23.62 99.57,17.48 108.92,8.13 108.92,6.91 105.26,3.25 86.36,3.25 84.98,1.87 SJ201.2 | LD101.K 52.07,65.41 J607.1 | U101.P6 94.61,50.8 92.71,52.7 92.71,67.94 | 92.71,67.94 106.06,67.94 106.69,67.31 | 14.01,32.92 3.91,32.92 1.91,34.92 1.91,44.89 U201.4 | 22.86,45.72 22.86,52.07 21.59,53.34 C203.-
  Bottom 0.813: C301.2 20.11,41.7 22.86,44.45 22.86,45.72
  Bottom 1.016: 11.43,54.41 U201.4
  pour Bottom (isolate 0.406, rank 6): 0,0 113.03,0 113.03,74.93 0,74.93
MISO
  Bottom 0.406: IC403.15 62.64,29.21 63.8,28.04 63.8,22.76 67.87,18.69 78.84,18.69 83.72,13.82 84.29,13.82 U$3.S6
MOSI
  Bottom 0.406: IC403.14 58.42,27.94 57.15,26.67 57.15,24.54 64.62,17.07 77.62,17.07 83.31,11.38 90.22,11.38 91.44,12.6 91.44,17.07 90.63,17.88 87.78,17.88 86.97,17.07 86.97,16.22 U$3.S3
MTR_RXD
  Bottom 0.406: U$4.Y15 71.75,48.95 73.97,46.74 89.41,46.74 92.25,43.89 92.25,36.58 91.24,35.56 IC401.4
MTR_TXD
  Bottom 0.406: U$4.Y16 74.3,48.84 75.59,47.55 89.81,47.55 93.07,44.3 93.07,35.36 90.73,33.02 IC402.1
N$1
  Bottom 0.406: IC501.2 29.03,31.11 30.79,29.36 T501.3
N$3
  Bottom 0.61: LD101.A 57.37,54.61 R101.2
N$4
  Bottom 1.016: U101.P3 102.23,56.52 104.46,58.74 J101.D+
N$5
  Bottom 0.813: IC301.10 48.26,33.02 Q301.1 49.74,31.54 C303.2
N$6
  Bottom 0.813: IC301.9 45.72,33.02 Q301.2 44.23,31.54 C302.2
N$7
  Bottom 1.016: U101.P4 99.69,58.74 101.28,60.33 102.46,60.33 J101.D-
N$8
  Bottom 1.016: J101.VBUS 100.16,62.84 D101.A
N$9
  Bottom 0.61: U$7.Z7 R101.1
N$10
  Bottom 0.406: U$5.X8 71.69,13.65 69.9,15.44 63.8,15.44 57.71,21.54 48.95,21.54 J102.1
N$11
  Bottom 0.406: U$5.X5 74.13,13.65 71.53,16.26 64.21,16.26 56.49,23.98 49.05,23.98 J102.2
N$14
  Bottom 0.61: IC301.21 C304.2
N$19
  Bottom 0.61: R603.1 J611.2
N$20
  Bottom 0.61: R604.1 J611.3
N$21
  Bottom 0.406: C401.1 67.46,20.32 64.62,23.16 64.62,29.67 62.53,31.75 IC403.17 58.63,31.75 R405.1 58.27,31.39 D401.A
N$22
  Bottom 0.61: IC403.8 72.39,24.13 Q401.1 74.51,22.01 C403.2
N$23
  Bottom 0.61: IC403.7 72.39,25.4 Q401.2 74.51,27.52 C404.2
N$24
  Bottom 0.406: R404.2 53.34,31.19
  Bottom 0.61: 53.34,26.67 R404.2
  Bottom 1.27: LD401.A 54.61,25.4 53.34,26.67
N$85
  Bottom 0.406: T501.1 34.19,25.18 R504.2 R503.2
N$86
  Bottom 0.406: R501.1 32.41,22.86 26.7,28.57 IC501.1
N$89
  Bottom 0.406: IC501.3 19.28,31.11 25.2,25.2 25.2,22.23
  Bottom 0.813: Q501.G 24.13,21.27 25.08,22.23 25.2,22.23 R502.2
N$90
  Bottom 0.61: D602.C J611.4
N$106
  Bottom 0.61: J610.4 77.47,67.31 80.01,64.77 D601.C
N$107
  Bottom 0.61: J610.2 74.08,63.72 R601.2
N$108
  Bottom 0.61: J610.3 74.93,65.41 77.47,65.41 78.11,64.77 R602.2
P_ENABLE
  Bottom 0.61: U$9.Y11 76.83,50.16 78.11,51.44 78.11,58.42 75.56,60.96 R601.1
P_FAULT_RESET
  Bottom 0.61: U$9.Y9 79.38,59.05 78.11,60.33 R602.1
P_FEED1
  Bottom 0.406: J612.3 14.61,67.84 17.07,70.31 23.98,70.31 25.2,69.09 25.2,45.92 23.98,44.7 23.98,41.86 24.79,41.05 28.45,41.05 33.02,36.47 IC301.4
  Bottom 0.61: R606.1 J612.3
P_FEED2
  Bottom 0.406: J612.2 12.06,67.74 15.44,71.12 24.38,71.12 26.01,69.49 26.01,43.79 IC301.28
  Bottom 0.61: R608.1 J612.2
P_FEED3
  Bottom 0.406: R610.1 9.53,68.05 13.41,71.93 24.79,71.93 26.82,69.9 26.82,44.3 IC301.27
  Bottom 0.61: R610.1 J612.1
P_HALL1/A
  Bottom 0.61: R605.1 J613.3 R606.2
P_HALL2/B
  Bottom 0.61: R607.1 J613.4 R608.2
P_HALL3/Z
  Bottom 0.61: R609.1 J613.5 R610.2
P_HEALTH
  Bottom 0.61: U$9.Y7 81.92,50.16 80.64,51.44 80.64,59.69 80.01,60.33 D601.A
P_HOME_SWITCH
  Bottom 0.61: U$7.Z5 61.59,61.54 56.49,66.65 56.49,67.28 J607.2
P_VDD
  Bottom 0.61: J612.6 21.89,66.98 21.89,60.96 19.77,58.84 R605.2 R607.2 R609.2 9.03,58.84 6.99,60.88 J613.6
RX+
  Bottom 0.406: IC401.6 99.91,38.1 R401.1 103.14,38.52 104.04,39.42 105.26,39.42 | 105.26,39.42 105.36,39.42 | 105.26,39.42 105.31,39.37 J608.2 106.53,39.37 108.1,37.8 108.1,27.64 103.63,23.16 103.63,20.73 104.67,19.68 J609.2
RX-
  Bottom 0.406: IC401.7 99.91,40.64 R401.2 102.02,41.91 J608.1 106.83,41.91 108.92,39.83 108.92,25.73 J609.1
RXCAN
  Bottom 0.406: IC403.2 76.35,31.75 79.65,28.45 84.53,28.45 85.09,29.01 IC404.4
SCK
  Bottom 0.406: IC403.13 62.33,26.67 62.99,26.01 62.99,22.35 67.46,17.88 78.03,17.88 83.72,12.19 86.16,12.19 86.97,13.01 86.97,13.63 U$3.S4
T_DOWN_LIM
  Bottom 0.61: U$7.Z1 66.67,49.53 64.14,52.07 64.14,63.5 61.59,66.04 J607.4
T_ENABLE
  Bottom 0.61: U$9.Y5 R603.2
T_FAULT_RESET
  Bottom 0.61: U$9.Y3 R604.2
T_FEED1
  Bottom 0.406: J614.3 38.73,67.64 36.47,69.9 32.51,69.9 27.64,65.02 27.64,46.34 29.21,44.77 29.21,41.5 29.67,41.05 30.89,41.05 35.56,36.37 IC301.5
  Bottom 0.61: R616.1 J614.3
T_FEED2
  Bottom 0.406: J614.2 36.2,67.74 34.85,69.09 32.92,69.09 28.45,64.62 28.45,46.74 30.48,44.7 IC301.26
  Bottom 0.61: R614.1 J614.2
T_FEED3
  Bottom 0.406: R612.1 31.89,65.62 29.26,62.99 29.26,47.14 33.02,43.38 IC301.25
  Bottom 0.61: R612.1 J614.1
T_HALL1/A
  Bottom 0.61: R615.1 J615.3 R616.2
T_HALL2/B
  Bottom 0.61: R613.1 J615.4 R614.2
T_HALL3/Z
  Bottom 0.61: R611.1 J615.5 R612.2
T_HEALTH
  Bottom 0.61: U$9.Y1 D602.A
T_UP_LIM
  Bottom 0.61: J607.3 59.05,66.52 62.87,62.71 62.87,50.8 64.14,49.53 U$7.Z3
T_VDD
  Bottom 0.61: J615.6 31.11,60.53 32.8,58.84 R611.2 R613.2 R615.2 44.41,58.84 45.72,60.15 45.72,66.67 J614.6
TRIGGER_PWR_RTN
  Bottom 1.676: D502.A 26.48,11.24 J606.1 26.67,14.61 26.67,15.05 | 26.67,15.05 D501.A | Q501.D 26.67,15.05
TX+
  Bottom 0.406: IC402.6 99.91,27.94 R402.1 | R402.1 100.7,28.36 105.41,33.07 J608.4 | J609.4 104.88,14.61 102.01,17.48 102.01,26.68 R402.1
TX-
  Bottom 0.406: IC402.7 99.91,30.48 R402.2 100.37,30.06 103.63,33.33 103.63,35.76 104.7,36.83 J608.3 106.22,36.83 107.29,35.76 107.29,28.04 102.82,23.57 102.82,19.1 104.78,17.14 J609.3
TXCAN
  Bottom 0.406: IC403.1 76.3,33.02 79.25,30.07 81.21,30.07 IC404.1
V+
  Bottom 0.61: U201.1 16.19,25.72 IC501.4
  Bottom 0.813: J601.1 61.59,7.94 62.55,8.89 78.74,8.89 J603.6
  Bottom 1.676: J606.2 21.78,11.24 D502.C 21.78,5.21 22.86,4.13 34.92,4.13 39.37,8.57 J605.1 43.5,11.43 45.4,9.53 C602.+ 47.62,8.57 52.07,4.13 55.88,4.13 58.42,6.67 J601.2 | J606.2 21.59,15.05 D501.C | J606.2 J604.1 C601.+ 13.97,23.18 U201.1 | J601.1 J601.2 | J601.2 58.42,9.4 D201.C
  pour Bottom (isolate 0.508): 57.15,12.7 60.33,12.7 62.87,10.16 62.87,7.62 58.42,3.17 17.78,3.17 11.43,9.53 11.43,24.77 15.24,28.57 20.32,28.57 24.13,24.77 24.13,6.99 25.4,5.71 33.66,5.71 36.83,8.89 36.83,12.7 37.47,13.34 45.09,13.34 52.07,6.35 56.52,6.35 57.15,6.99
V-
  Bottom 0.61: 82.79,4.99 82.15,5.63 | SJ201.1 81.28,5.08
  Bottom 0.813: Q501.S 29.21,21.27 28.26,22.23 R502.1
  Bottom 1.676: 54.61,12.38 54.8,12.19 D201.A 54.61,10.29 54.61,8.26 | 54.61,12.38 52.39,14.61 C602.- 46.67,14.61 45.72,15.56 36.2,15.56 34.29,13.65 | 34.29,13.65 J605.2 | 34.29,13.65 34.29,13.97 Q501.S | 54.61,12.38 56.2,13.97 60.96,13.97 64.14,10.79 80.64,10.79 82.55,8.89 J603.5 82.55,6.03 82.15,5.63 81.6,5.08 81.28,5.08 78.74,5.08 76.83,6.99 64.14,6.99 59.05,1.91 15.56,1.91 8.89,8.57 J604.2 C601.- 8.89,19.05 5.08,22.86 2.86,22.86 1.91,23.81 1.91,25.33 U201.2 | J601.3 54.93,7.94 54.61,8.26 | J601.4 54.29,7.94 54.61,8.26
  pour Bottom (isolate 0.508, rank 2): 0,0 80.01,0 83.19,3.17 83.59,9.3 77.34,15.54 63.5,15.14 58.95,19.68 29.84,19.68 20.32,29.21 0,29.21
VCC
  Bottom 0.406: IC403.18 61.12,33.23 R405.2 58.27,33.38 D401.C 53.49,33.38 R404.1 | D301.C 19.95,35.71 R301.2 | IC404.3 83.82,32.17 C402.1
  Bottom 0.61: IC301.20 C305.1 | IC401.2 IC401.3 | U101.P5 97.16,43.81 IC401.8 97.69,43.08 95.1,43.08 94.28,42.27 94.28,34.14 | 61.37,36.98 61.37,33.05 IC403.18 | 83.72,36.98 83.72,34.14 84.12,33.73 84.12,32.48 | 84.12,32.48 87.54,32.48 88.27,31.75 91.9,31.75 94.28,34.14 | 84.12,32.48 C402.1 | IC402.8 95.4,33.02 94.28,34.14
  Bottom 0.813: 45.52,39.42 44.3,38.2 41.45,38.2 40.64,37.39 IC301.7 40.64,33.33 38.61,31.29 30.48,31.29 28.45,33.33 21.54,33.33 20.11,34.76 R301.2 18.9,35.56 17.88,36.58 17.88,42.01 20.32,44.45 C203.+ | 45.52,39.42 46.74,38.2 60.15,38.2 61.37,36.98 62.59,38.2 82.5,38.2 83.72,36.98 84.94,38.2 90.07,38.2 IC401.3 | 45.52,39.42 45.52,42.98 IC301.20
  Bottom 1.016: D101.C 95.44,53.47 97.16,51.75 U101.P5 | U201.3 16.19,48.58 17.57,49.95 C204.1 19.27,49.95 20.32,48.9 C203.+
VIDEO+
  Bottom 0.406: J603.2 90.17,7.37 91.44,6.1 100.38,6.1 101.6,7.32 J602.3
VIDEO-
  Bottom 0.406: J603.1 J602.4

### Text on the board
Bottom: RWS-motorDriver_20180119 | -RESPATI-